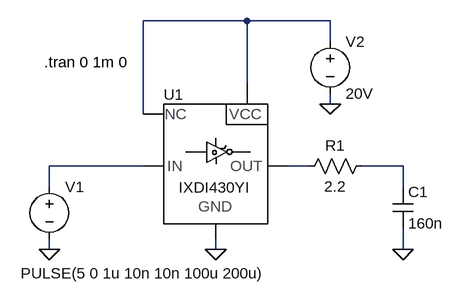
[diagram p0: schematic IXDI430YI-TEST1.asc]
IXDI430YI-TEST1.asc, the LTspice schematic file:
Version 4
SHEET 1 1252 680
WIRE 144 -256 -16 -256
WIRE 272 -256 144 -256
WIRE 272 -224 272 -256
WIRE 144 -160 144 -256
WIRE 272 -128 272 -144
WIRE -16 -112 -16 -256
WIRE -16 -32 -160 -32
WIRE 240 -32 208 -32
WIRE 384 -32 320 -32
WIRE -160 0 -160 -32
WIRE 384 0 384 -32
WIRE -160 96 -160 80
WIRE 96 96 96 80
WIRE 384 96 384 64
FLAG -160 96 0
FLAG 272 -128 0
FLAG 384 96 0
FLAG 96 96 0
SYMBOL voltage -160 -16 R0
WINDOW 3 -44 149 Left 0
WINDOW 123 0 0 Left 0
WINDOW 39 0 0 Left 0
SYMATTR Value PULSE(5 0 1u 10n 10n 100u 200u)
SYMATTR InstName V1
SYMBOL voltage 272 -240 R0
WINDOW 123 0 0 Left 0
WINDOW 39 0 0 Left 0
SYMATTR InstName V2
SYMATTR Value 20V
SYMBOL cap 368 0 R0
SYMATTR InstName C1
SYMATTR Value 160n
SYMBOL res 336 -48 R90
WINDOW 0 0 56 VBottom 0
WINDOW 3 32 56 VTop 0
SYMATTR InstName R1
SYMATTR Value 2.2
SYMBOL IXDI430YI 96 -160 R0
SYMATTR InstName U1
TEXT -168 -192 Left 0 !.tran 0 1m 0

The netlist it stands for:
* IXDI430YI-TEST1.asc
V1 N002 0 PULSE(5 0 1u 10n 10n 100u 200u)
V2 N001 0 20V
C1 N004 0 160n
R1 N004 N003 2.2
XU1 N001 N003 0 N002 N001 IXDI430YI  ; pins VCC OUT GND IN NC
.tran 0 1m 0
.lib IXDI430YI_lt.lib
.backanno
.end